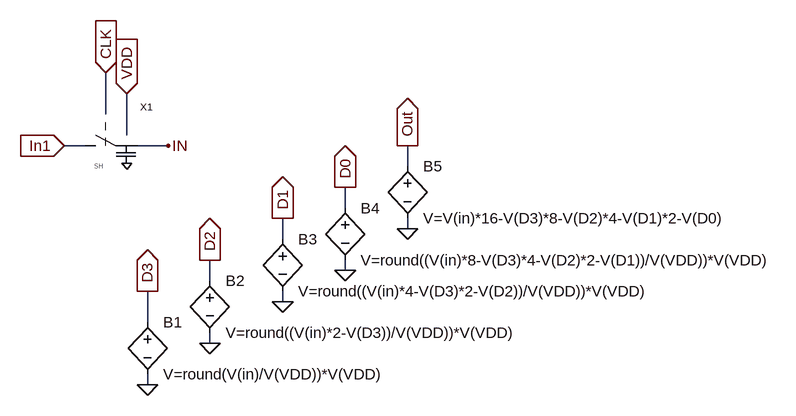
[diagram p0: schematic 4Bit_ADC_pipe.asc]
4Bit_ADC_pipe.asc, the LTspice schematic file:
Version 4
SHEET 1 1812 680
WIRE 48 -272 48 -336
WIRE 80 -240 80 -304
WIRE 16 -224 -16 -224
WIRE 144 -224 96 -224
WIRE 512 -192 512 -224
WIRE 416 -128 416 -160
WIRE 512 -96 512 -112
WIRE 320 -80 320 -112
WIRE 416 -32 416 -48
WIRE 208 -16 208 -48
WIRE 320 16 320 0
WIRE 112 48 112 0
WIRE 208 80 208 64
WIRE 112 144 112 128
FLAG 144 -224 IN
FLAG 112 144 0
FLAG 112 0 D3
IOPIN 112 0 Out
FLAG 208 80 0
FLAG 208 -48 D2
IOPIN 208 -48 Out
FLAG 320 16 0
FLAG 320 -112 D1
IOPIN 320 -112 Out
FLAG 416 -32 0
FLAG 416 -160 D0
IOPIN 416 -160 Out
FLAG 512 -96 0
FLAG 512 -224 Out
IOPIN 512 -224 Out
FLAG -16 -224 In1
IOPIN -16 -224 In
FLAG 48 -336 CLK
IOPIN 48 -336 In
FLAG 80 -304 VDD
IOPIN 80 -304 In
SYMBOL bv 112 32 R0
SYMATTR InstName B1
SYMATTR Value V=round(V(in)/V(VDD))*V(VDD)
SYMBOL bv 208 -32 R0
SYMATTR InstName B2
SYMATTR Value V=round((V(in)*2-V(D3))/V(VDD))*V(VDD)
SYMBOL bv 320 -96 R0
SYMATTR InstName B3
SYMATTR Value V=round((V(in)*4-V(D3)*2-V(D2))/V(VDD))*V(VDD)
SYMBOL bv 416 -144 R0
SYMATTR InstName B4
SYMATTR Value V=round((V(in)*8-V(D3)*4-V(D2)*2-V(D1))/V(VDD))*V(VDD)
SYMBOL bv 512 -208 R0
SYMATTR InstName B5
SYMATTR Value V=V(in)*16-V(D3)*8-V(D2)*4-V(D1)*2-V(D0)
SYMBOL sample_hold 16 -208 R0
SYMATTR InstName X1

The netlist it stands for:
* 4Bit_ADC_pipe.asc
B1 D3 0 V=round(V(in)/V(VDD))*V(VDD)
B2 D2 0 V=round((V(in)*2-V(D3))/V(VDD))*V(VDD)
B3 D1 0 V=round((V(in)*4-V(D3)*2-V(D2))/V(VDD))*V(VDD)
B4 D0 0 V=round((V(in)*8-V(D3)*4-V(D2)*2-V(D1))/V(VDD))*V(VDD)
B5 Out 0 V=V(in)*16-V(D3)*8-V(D2)*4-V(D1)*2-V(D0)
XX1 In1 IN CLK VDD sample_hold  ; pins P1 P2 clk VDD
.backanno
.end